# Altium schematic sheet Pressure_Transducer.SchDoc
size A
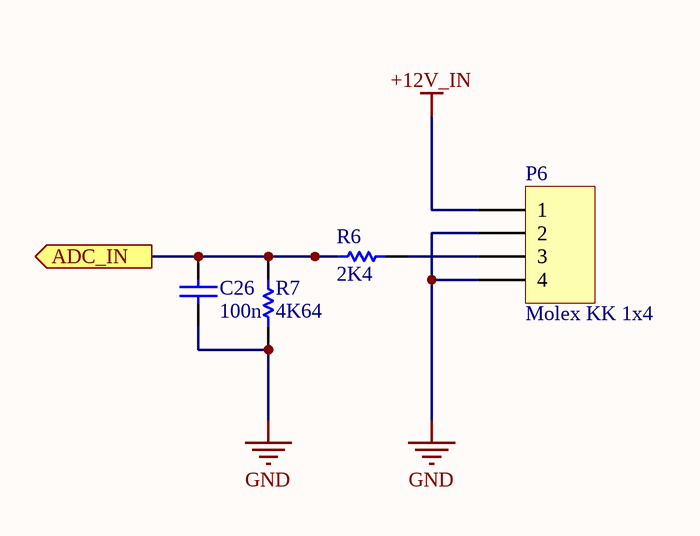
[diagram p0: Pressure_Transducer.SchDoc]

## Parts
C26  100n  [C0805]
P6  Molex KK 1x4  [Molex KK 4x1]
R6  2K4  [R0805]
R7  4K64  [R0805]

## Ports
ADC_IN (out)

## Nets
+12V_IN: P6.1
GND: C26.2 P6.2 P6.4 R7.1
ADC_IN: C26.1 R6.2 R7.2 ; port ADC_IN
NetP6_3: P6.3 R6.1

## Library data of the parts
C26 = C0805: 0805 Capacitor; Value: 100n
P6 = Molex KK 1x4: 1x4 Molex KK Connector
R6 R7 = R0805: RESISTOR 0805
  R6: Value: 2K4
  R7: Value: 4K64